# EAGLE design nucleum_logger (EAGLE 6.6.0)
AUTHOR: Joshua Adkins; REV: REV_B; TITLE: Nucleum Logger
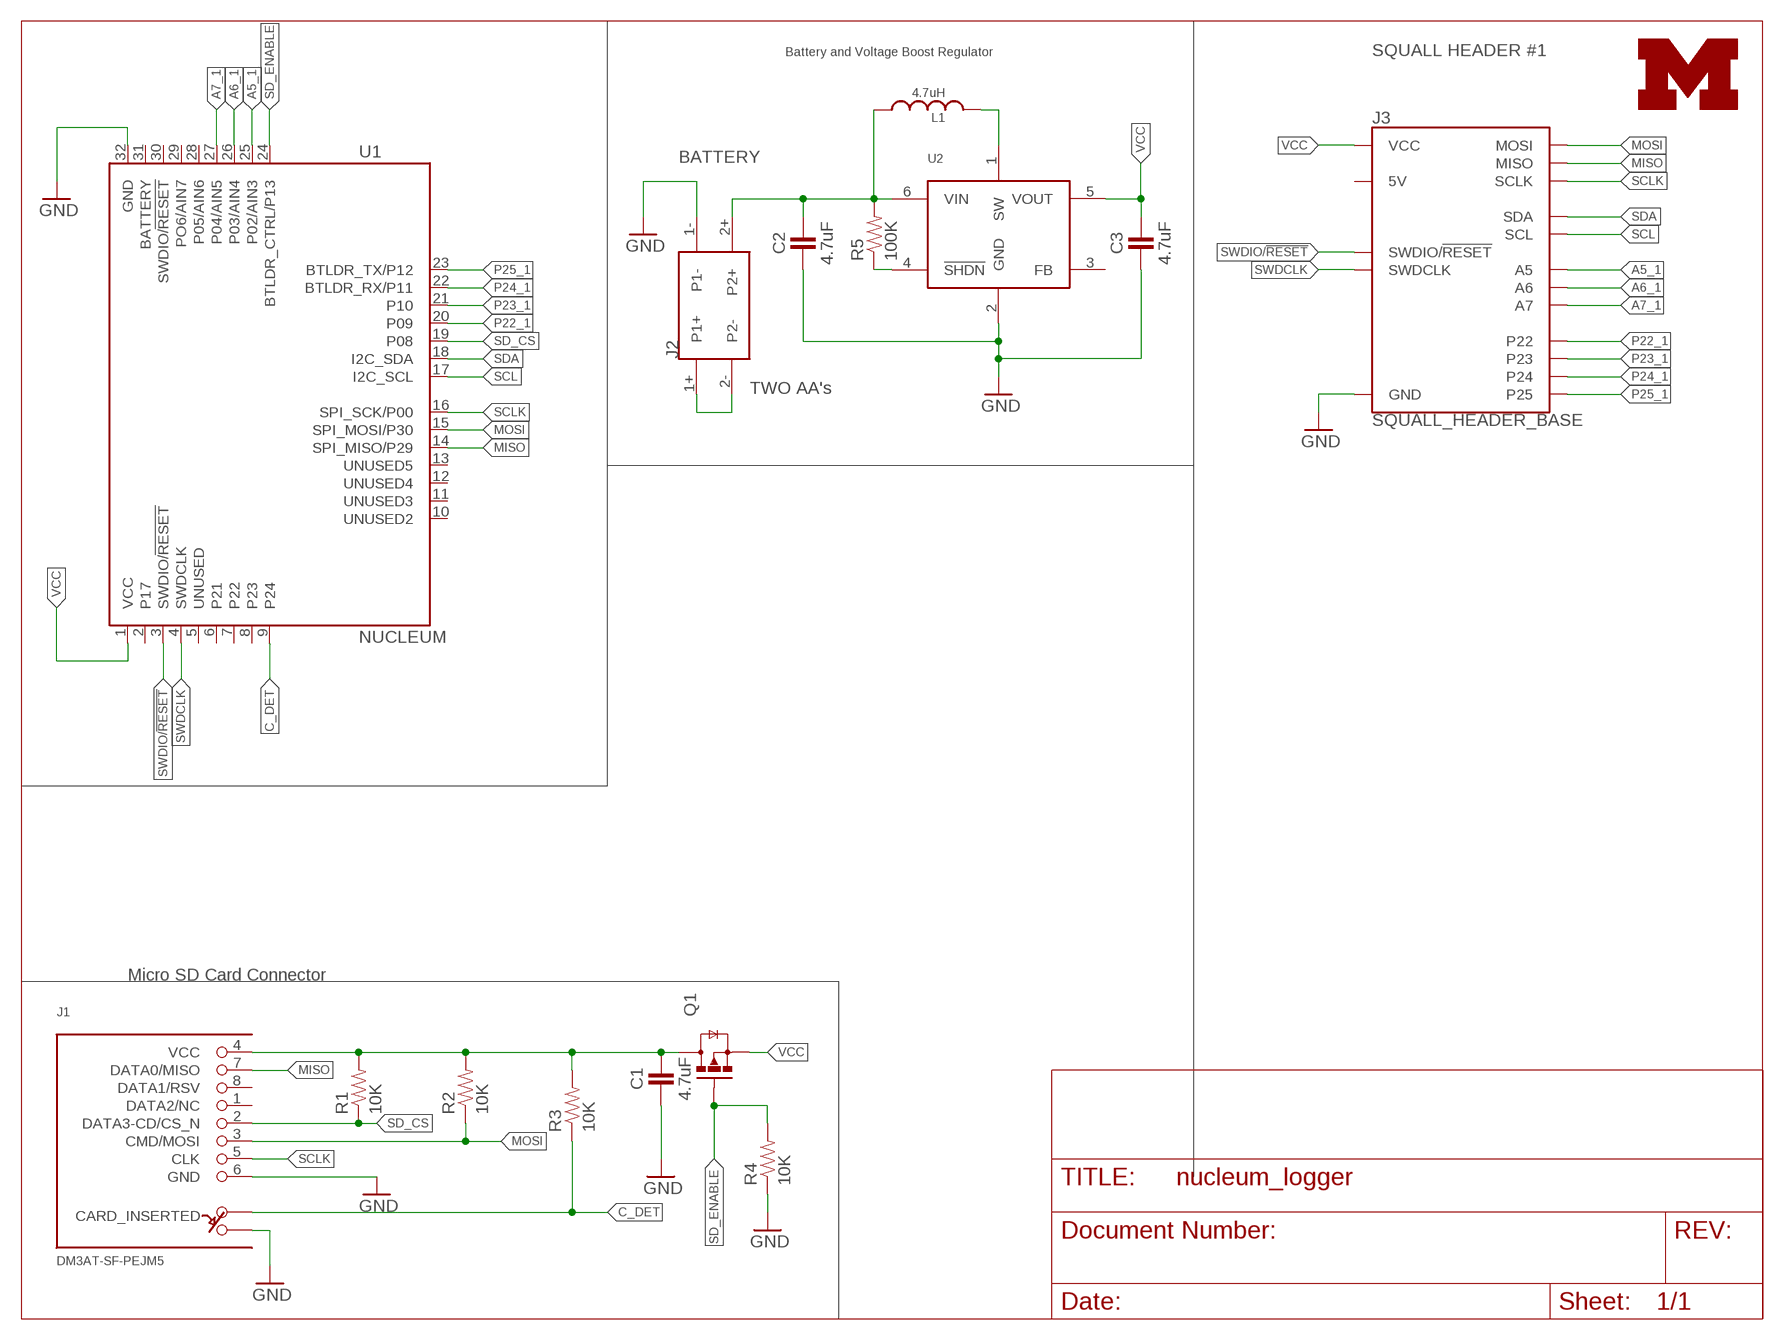
[diagram p0: schematic, sheet 1]

## Parts
C1  4.7uF  CAPACITOR0603_CAP  [0603_CAP]
C2  4.7uF  CAPACITOR0603_CAP  [0603_CAP]
C3  4.7uF  CAPACITOR0603_CAP  [0603_CAP]
J1  DM3AT-SF-PEJM5  [DM3AT-SF-PEJM5]
J2  AA_BAT_PACKSMD  [AA_SMD]
J3  SQUALL_HEADER_BASE  [SQUALL_CARRIER]
L1  4.7uH  INDUCTORVLF3012A  [VLF3012A]
LOGO1  UMICH_SOLID_SMALL  [UMICH_SOLID_75MIL]
Q1  NX3008PBK  [SOT23-3]
R1  10K  RESISTOR  [0603-RES]
R2  10K  RESISTOR  [0603-RES]
R3  10K  RESISTOR  [0603-RES]
R4  10K  RESISTOR  [0603-RES]
R5  100K  RESISTOR  [0603-RES]
U1  NUCLEUM  [NUCLEUM]
U2  AAT12173.3V  [SOT-23-6]

## Nets
A5_1: J3.B9(A5) U1.25(P02/AIN3)
A6_1: J3.B7(A6) U1.26(P03/AIN4)
A7_1: J3.B5(A7) U1.27(P04/AIN5)
C_DET: J1.A R3.1 U1.9(P24)
GND: C1.2 C2.2 C3.2 J1.6(GND) J1.B J2.1- J3.A9(GND) J3.A10(GND) R4.1 U1.32(GND) U2.2(GND)
MISO: J1.7(DATA0/MISO) J3.B8(MISO) U1.14(SPI_MISO/P29)
MOSI: J1.3(CMD/MOSI) J3.B6(MOSI) R2.1 U1.15(SPI_MOSI/P30)
N$1: J2.1+ J2.2-
N$3: R5.1 U2.4(!SHDN)
N$4: L1.P$2 U2.1(SW)
P22_1: J3.A2(P22) U1.20(P09)
P23_1: J3.A4(P23) U1.21(P10)
P24_1: J3.A6(P24) U1.22(BTLDR_RX/P11)
P25_1: J3.A8(P25) U1.23(BTLDR_TX/P12)
SCL: J3.B3(SCL) U1.17(I2C_SCL)
SCLK: J1.5(CLK) J3.B10(SCLK) U1.16(SPI_SCK/P00)
SD_CS: J1.2(DATA3-CD/CS_N) R1.1 U1.19(P08)
SD_ENABLE: Q1.1(G) R4.2 U1.24(BTLDR_CTRL/P13)
SDA: J3.B1(SDA) U1.18(I2C_SDA)
SWDCLK: J3.B2(SWDCLK) U1.4(SWDCLK)
SWDIO/!RESET: J3.B4(SWDIO/!RESET) U1.3(SWDIO/!RESET)
V_BAT: C2.1 J2.2+ L1.P$1 R5.2 U2.6(VIN)
V_SD: C1.1 J1.4(VCC) Q1.3(D) R1.2 R2.2 R3.2
VCC: C3.1 J3.A1(VCC) J3.A3(VCC) Q1.2(S) U1.1(VCC) U2.5(VOUT)
Unconnected: J1.1(DATA2/NC) J1.8(DATA1/RSV) J3.A5(5V) J3.A7(5V) U1.2(P17) U1.5(UNUSED) U1.6(P21) U1.7(P22) U1.8(P23) U1.10(UNUSED2) U1.11(UNUSED3) U1.12(UNUSED4) U1.13(UNUSED5) U1.28(P05/AIN6) U1.29(PO6/AIN7) U1.30(SWDIO/!RESET) U1.31(BATTERY) U2.3(FB)

## Notes on the sheet
- Battery and Voltage Boost Regulator | SQUALL HEADER #1
- BATTERY
- TWO AA's
- Micro SD Card Connector

## Library data of the parts
C1-C3 = passives:CAPACITOR: 0402 Capacitor
J1 = connector:DM3AT-SF-PEJM5: CONN MICRO SD R/A PUSH-PUSH SMD; DIGIKEY: HR1964CT-ND
J2 = connector:AA_BAT_PACK: Types of AA Battery Packs
J3 = squall:SQUALL_HEADER: Header for a sensor board on top of the Squall BLE tag board. Requires two DF40C-10DS-0.4V(51).
L1 = passives:INDUCTOR: A very specific inductor; DIGIKEY: 445-3225-1-ND
LOGO1 = logos:UMICH_SOLID
Q1 = fets:NX3008PBK: MOSFET - P Channel; DIGIKEY: 568-10499-1-ND; MOUSER: 771-NX3008PBK,215; NEWARK: 74T4665
R1-R5 = passives:RESISTOR: Resistor Basic schematic elements and footprints for 0603, 1206, and PTH resistors.
U1 = nucleum:NUCLEUM: Nucleum sensorboard prototyping module.
U2 = chips:AAT1217: A Simple boost converter; DIGIKEY: 863-1496-1-ND

## Board
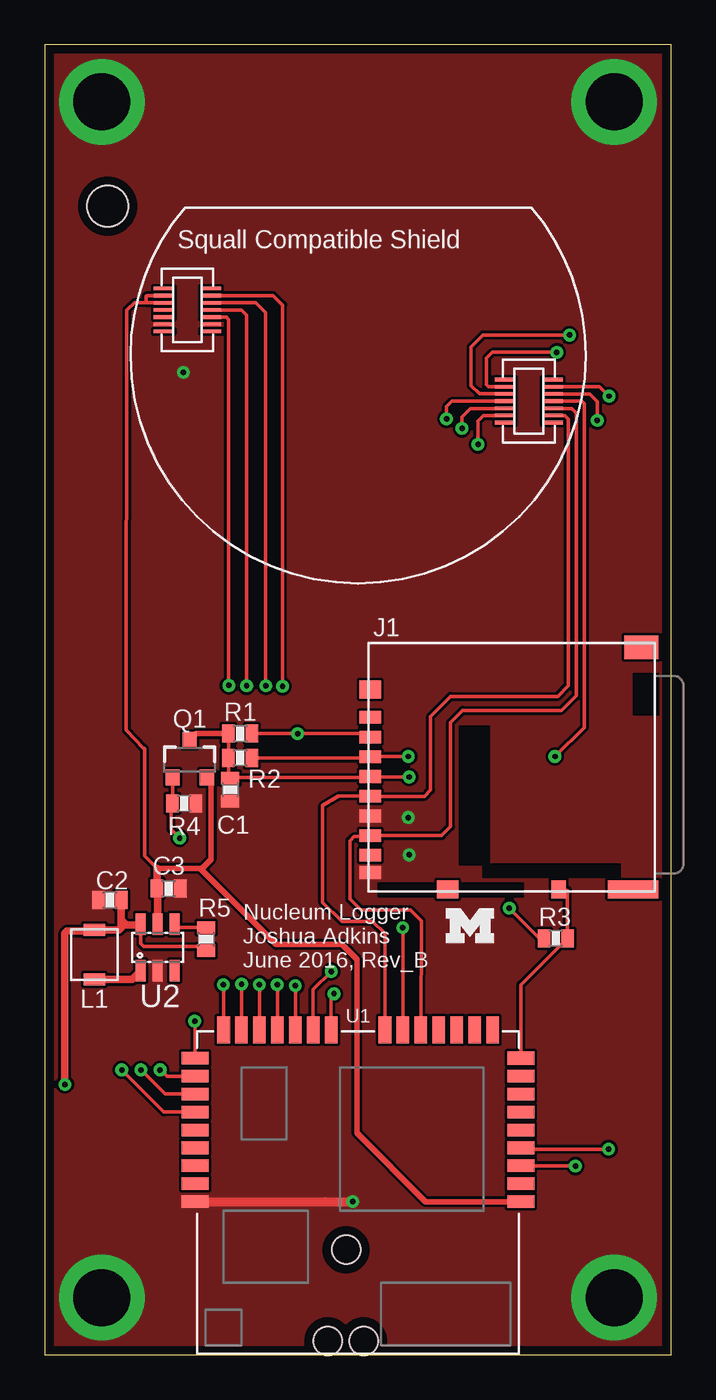
[diagram p1: board, top side]
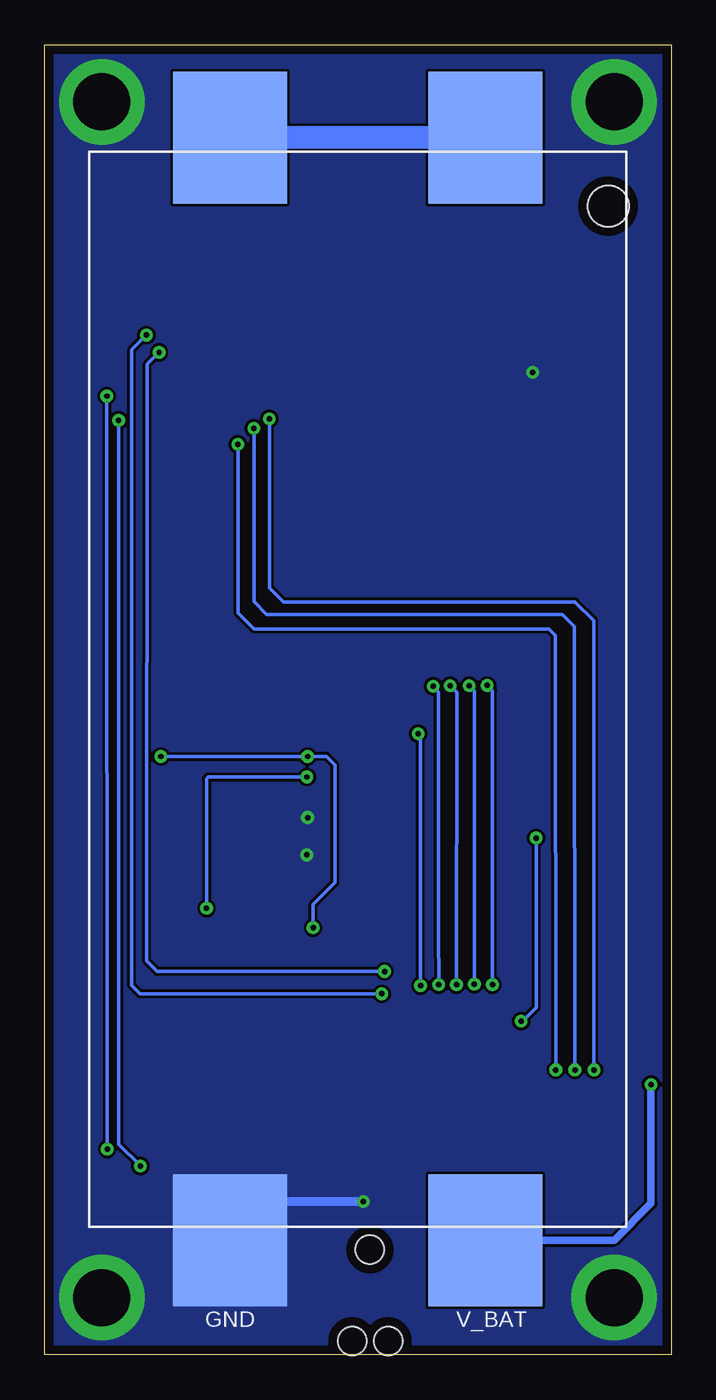
[diagram p2: board, bottom side, seen from below]

Size 34.92 x 73.03 mm. Coordinates in mm from the lower left corner, seen from the top.
Outline: 0,0 34.92,0 34.92,73.03 0,73.03 0,0
Copper layers (1*16): Top 0.0178mm / dielectric 59mil / Bottom 0.0178mm
Design rules "sunstone-2lyr_v1.0.0.3": minimum track width 6mil, minimum drill 14mil, track to track 6mil, track to pad 6mil, pad to pad 6mil, via to via 6mil, smd to smd 6mil, copper to edge 20mil, drill to drill 16mil, minimum pad ring 8mil, minimum via ring 8mil, stop-mask expansion 3mil, vias tented up to drill 50mil, thermal gap 10mil

### Footprints (pad centres in the part's own frame; a part is rotated, then mirrored left to right if it is on the bottom)
0603_CAP = smd 0.7 x 1: 1 -0.65,0; 2 0.65,0
DM3AT-SF-PEJM5 = smd 0.7 x 1.2: 1 3.2,-0.1; 2 2.1,-0.1; 3 1,-0.1; 4 -0.1,-0.1; 5 -1.2,-0.1; 6 -2.3,-0.1; 7 -3.4,-0.1; 8 -4.5,-0.1; B -5.45,-0.1 | smd 1 x 0.8: A -6.4,-10.6 | smd 1 x 1.2: MOUNT0 4.75,-0.1; MOUNT1 -6.4,-4.4 | smd 1 x 2.8: MOUNT2 -6.4,-14.75 | smd 1.3 x 1.9: MOUNT3 7.1,-15.2
AA_SMD = smd 6.35 x 7.366: 1+ -7.112,30.734; 1- -7.112,-30.734; 2+ 7.112,-30.734; 2- 7.112,30.734 | hole 2.286: 13.97,26.924
SQUALL_CARRIER = smd 1.14 x 0.2: A1 -10.845,3.34; A2 -8.205,3.34; A3 -10.845,2.94; A4 -8.205,2.94; A5 -10.845,2.54; A6 -8.205,2.54; A7 -10.845,2.14; A8 -8.205,2.14; A9 -10.845,1.74; A10 -8.205,1.74; A11 -10.845,3.74; A12 -10.845,1.34; A13 -8.205,3.74; A15 -8.205,1.34; B1 8.205,-1.74; B2 10.845,-1.74; B3 8.205,-2.14; B4 10.845,-2.14; B5 8.205,-2.54; B6 10.845,-2.54; B7 8.205,-2.94; B8 10.845,-2.94; B9 8.205,-3.34; B10 10.845,-3.34; B11 8.205,-1.34; B12 8.205,-3.74; B13 10.845,-1.34; B14 10.845,-3.74
VLF3012A = smd 0.65 x 1.2: P$1 -1.38,0; P$2 1.38,0
SOT23-3 = smd 0.8 x 0.9: 1 -0.95,-1; 2 0.95,-1; 3 0,1.1
0603-RES = smd 0.7 x 1: 1 -0.65,0; 2 0.65,0
NUCLEUM = smd 0.7 x 1.5: 1 8.481,-0.109; 2 9.481,-0.109; 3 10.481,-0.109; 4 11.481,-0.109; 5 12.481,-0.109; 6 13.481,-0.109; 7 14.481,-0.109; 8 15.481,-0.109; 24 16.481,18.049; 25 15.481,18.049; 26 14.481,18.049; 27 13.481,18.049; 28 12.481,18.049; 29 11.481,18.049; 30 10.481,18.049; 31 9.481,18.049; 32 8.481,18.049 | smd 0.754 x 1.5: 9 16.481,-0.109 | smd 1.5 x 0.7: 10 18.06,1.47; 11 18.06,2.47; 12 18.06,3.47; 13 18.06,4.47; 14 18.06,5.47; 15 18.06,6.47; 16 18.06,7.47; 17 18.06,10.47; 18 18.06,11.47; 19 18.06,12.47; 20 18.06,13.47; 21 18.06,14.47; 22 18.06,15.47; 23 18.06,16.47 | hole 1.6: 0.72,8.66; 0.72,10.66; 5.8,9.64
SOT-23-6 = smd 0.55 x 1.2: 1 -0.95,-1.3; 2 0,-1.3; 3 0.95,-1.3; 4 0.95,1.3; 5 0,1.3; 6 -0.95,1.3

### Placement (x,y rotation side)
C1  10.34,31.5 270 top
C2  3.63,25.35 180 top
C3  6.91,25.98 0 top
J1  18.06,32.33 90 top
J2  17.48,37.11 0 bottom
J3  17.48,55.7 0 top
L1  2.77,22.3 270 top
LOGO1  22.38,22.96 0 top
Q1  8.08,33.17 0 top
R1  10.9,34.62 180 top
R2  10.9,33.27 180 top
R3  28.5,23.22 180 top
R4  7.77,30.73 180 top
R5  8.99,23.16 270 top
U1  26.44,0.05 90 top
U2  6.3,22.71 0 top

### Tracks (layer width: path | path; a pad name or v marks a point on that pad's centre or on a via)
A5_1  (via drill 0.3)
  Top 0.203: U1.25 arc60 8.15,15.52 6.83,15.52 v6.43,15.88 | v24.16,50.75 24.16,52.05 24.46,52.35 25.46,52.35 J3.B9
  Bottom 0.203: v6.43,15.88 6.45,40.11 6.81,40.46 23.27,40.46 24.16,41.35 v24.16,50.75
A6_1  (via drill 0.3)
  Top 0.203: U1.26 6.71,14.53 v5.36,15.88 | v23.27,51.64 23.27,52.27 23.75,52.76 25.45,52.76 J3.B7
  Bottom 0.203: v5.36,15.88 5.38,40.59 6.07,41.27 22.55,41.27 23.27,41.99 v23.27,51.64
A7_1  (via drill 0.3)
  Top 0.203: U1.27 6.64,13.53 v4.29,15.88 | v22.4,52.17 22.4,52.86 22.71,53.16 J3.B5
  Bottom 0.203: v4.29,15.88 4.32,40.92 5.36,41.96 21.61,41.96 22.4,42.75 v22.4,52.17
C_DET
  Top 0.203: U1.9 26.55,20.62 R3.1 29.14,25.89 J1.A
GND  (via drill 0.3 pad 0.61, 3.17)
  Top 0.508: U1.32 15.64,8.53 v17.17,8.53
  Bottom 0.508: v17.17,8.53 21.74,8.53 J2.1-
  other vias: 20.27,29.95 20.32,27.86 7.72,54.76 3.17,69.85 31.75,69.85 31.75,3.17 3.17,3.17
  pour Top (no thermals): 0,0 0,73.05 34.9,73.03 34.9,0
  pour Bottom (no thermals): 0,0 0,73.05 34.9,73.03 34.9,0
MISO
  Top 0.203: U1.14 21,24.19 20.4,24.79 17.63,24.79 17.02,25.4 17.02,28.65 17.25,28.88 18.33,28.88 J1.7 22.13,28.93 22.63,29.44 22.63,35.26 23.29,35.92 28.8,35.92 29.64,36.75 29.64,52.5 29.39,52.76 J3.B8
MOSI  (via drill 0.3)
  Top 0.203: R2.1 18.63,33.27 J1.3 18.73,33.35 v20.27,33.35 | J3.B6 29.95,53.16 30.1,53.01 30.1,34.98 v28.45,33.35 | U1.15 v19.97,23.79 v19.96,23.8
  Bottom 0.203: v28.45,33.35 v20.27,33.35 19.23,33.35 18.75,32.87 18.75,26.31 19.96,25.09 v19.96,23.8
N$1
  Bottom 1.27: J2.2- J2.1+
N$3
  Top 0.203: R5.1 7.44,23.82 U2.4
N$4
  Top 0.406: L1.P$2 4.86,20.92 U2.1
P22_1  (via drill 0.3)
  Top 0.203: U1.20 12.97,20.53 v12.95,20.62 | v13.26,37.26 13.26,58.52 12.72,59.05 9.08,59.05 J3.A2
  Bottom 0.203: v12.95,20.62 12.98,23.6 12.98,36.93 13.26,37.21 v13.26,37.26
P23_1  (via drill 0.3)
  Top 0.203: U1.21 11.97,20.41 v11.96,20.62 | v12.32,37.29 12.32,58.09 11.76,58.65 9.09,58.65 J3.A4
  Bottom 0.203: v11.96,20.62 11.94,36.27 11.94,36.91 v12.32,37.29
P24_1  (via drill 0.3)
  Top 0.203: U1.22 10.97,20.55 v10.97,20.65 | v11.25,37.29 11.25,57.96 10.97,58.24 J3.A6 9.02,58.24
  Bottom 0.203: v10.97,20.65 10.97,37.01 v11.25,37.29
P25_1  (via drill 0.3)
  Top 0.203: U1.23 9.97,20.56 v9.96,20.62 | v10.26,37.31 10.26,57.71 10.13,57.84 9.05,57.84 J3.A8
  Bottom 0.203: v9.96,20.62 9.96,37.01 v10.26,37.31
SCL  (via drill 0.3)
  Top 0.203: U1.17 15.97,19.96 v16.13,20.12 | v29.26,56.84 24.43,56.84 23.77,56.19 23.77,54.03 24.23,53.57 25.47,53.57 J3.B3
  Bottom 0.203: v16.13,20.12 29.62,20.12 30.07,20.57 30.07,56.03 v29.26,56.84
SCLK
  Top 0.203: U1.16 18.97,23.47 18.29,24.16 16.56,24.16 15.49,25.22 15.49,30.61 16.38,31.14 18.7,31.14 J1.5 21.18,31.13 21.51,31.47 21.51,35.59 22.63,36.7 28.6,36.7 29.21,37.31 29.21,52.15 29.01,52.35 28.33,52.35 J3.B10
SD_CS  (via drill 0.3)
  Top 0.203: J1.2 18.56,34.62 v14.1,34.62 R1.1 | U1.19 v13.97,20.57
  Bottom 0.203: v13.97,20.57 13.97,34.49 v14.1,34.62
SD_ENABLE  (via drill 0.3)
  Top 0.203: Q1.1 R4.2 7.01,30.62 7.04,30.6 7.04,29.29 v7.52,28.8 | U1.24 8.39,18.51 v8.36,18.59
  Bottom 0.203: v8.36,18.59 8.28,18.59 7.52,19.36 v7.52,28.8
SDA  (via drill 0.3)
  Top 0.203: U1.18 14.97,20.36 v15.98,21.36 | v28.55,55.88 24.97,55.88 24.64,55.55 24.64,54.08 24.74,53.98 25.46,53.98 J3.B1
  Bottom 0.203: v15.98,21.36 28.65,21.36 29.23,21.95 29.21,55.22 v28.55,55.88
SWDCLK  (via drill 0.3 pad 0.61)
  Top 0.203: J3.B2 30.93,53.96 v31.47,53.44 | v31.45,11.46 26.83,11.46 U1.4
  Bottom 0.203: v31.47,53.44 v31.45,11.46
SWDIO/!RESET  (via drill 0.3 pad 0.61)
  Top 0.203: J3.B4 30.39,53.56 30.81,53.14 v30.81,52.09 | v29.59,10.52 26.49,10.52 U1.3
  Bottom 0.203: v30.81,52.09 30.81,11.73 v29.59,10.52
V_BAT  (via drill 0.3)
  Top 0.203: U2.6 5.35,22.92 5.51,22.76 8.6,22.76 R5.2
  Top 0.406: U2.6 5.29,23.95 4.55,23.95 4.26,24.24 C2.1 4.27,24.73 4.27,23.8 4.15,23.68 L1.P$1 2.71,23.62 1.25,23.62 1.12,23.5 v1.12,15.06
  Bottom 0.406: J2.2+ 3.17,6.38 1.12,8.43 v1.12,15.06
V_SD  (via drill 0.3)
  Top 0.203: R1.2 R2.2 10.25,32.24 C1.1 | C1.1 10.38,32.18 18.64,32.18 J1.4 18.77,32.21 v20.32,32.21 | 10.31,32.17 C1.1 | v25.91,24.89 27.58,23.22 R3.2
  Top 0.305: Q1.3 8.43,34.62 R1.2
  Bottom 0.203: v25.91,24.89 25.91,32.11 25.81,32.21 v20.32,32.21
VCC
  Top 0.203: J3.A1 5.7,59.04 5.64,59 5.64,58.73 5.69,58.65 | 5.69,58.65 6.42,58.65 J3.A3 | 6.26,27.12 5.56,27.81 5.56,33.78 5.54,33.76 5.49,33.83 4.55,34.82 4.57,58.24 5,58.65 5.69,58.65
  Top 0.305: U1.1 21.24,8.53 17.4,12.37 17.4,22.05 16.59,22.86 12.9,22.86 8.66,27.1 | 8.66,27.1 6.27,27.1 6.26,27.12 | Q1.2 9.27,31.93 9.27,27.61 8.76,27.1 8.66,27.1
  Top 0.406: U2.5 6.3,25.94 C3.1 6.26,27.12

### Text on the board
tNames: Squall Compatible Shield | Nucleum Logger / Joshua Adkins / June 2016, Rev_B
bNames: V_BAT | GND